# EAGLE design main (EAGLE 7.4.0)
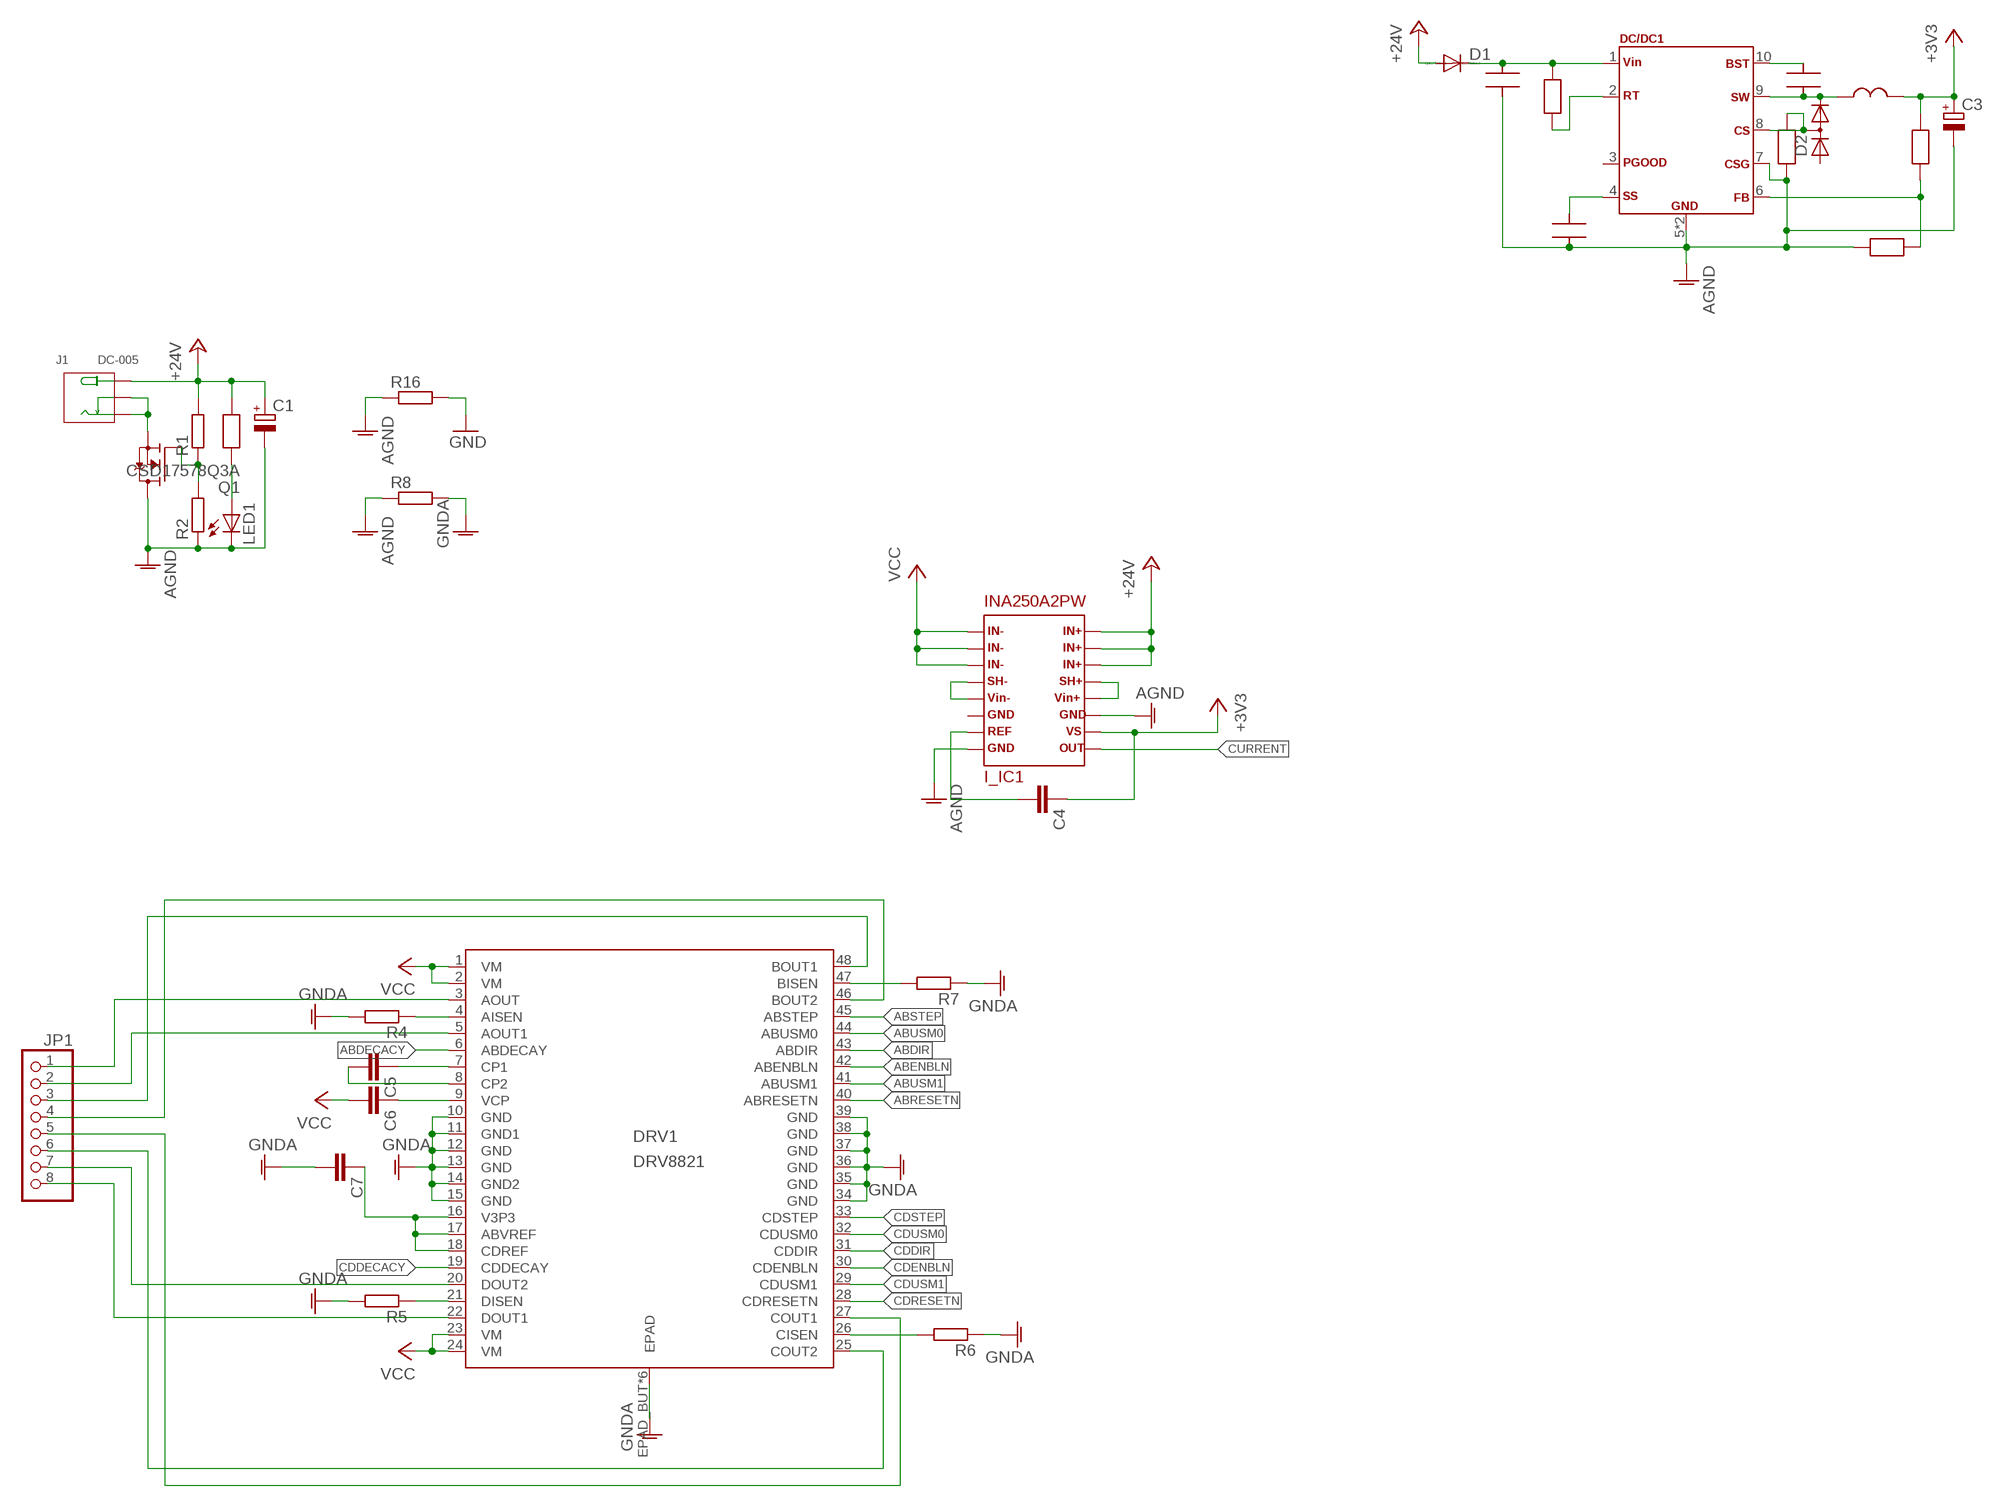
[diagram p0: schematic, sheet 1, part 1 of 2]
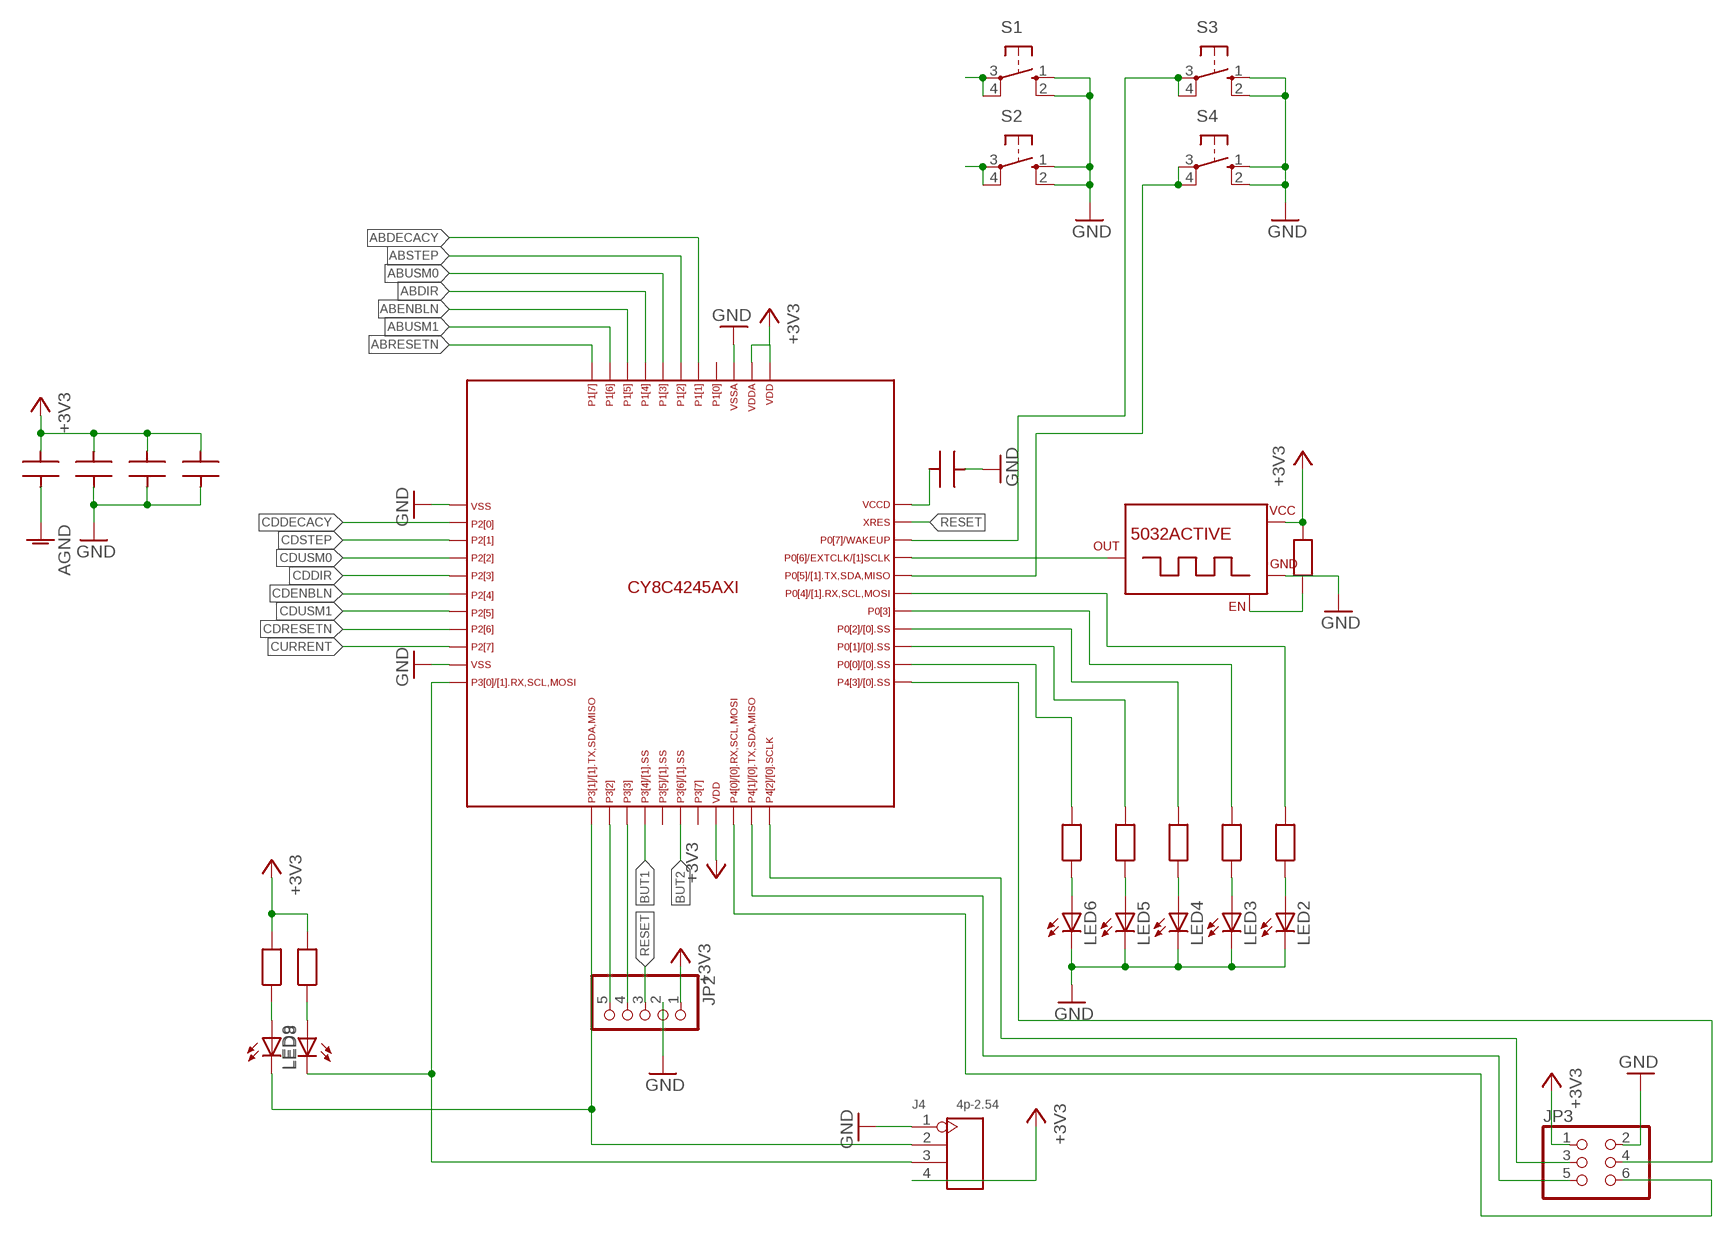
[diagram p1: schematic, sheet 1, part 2 of 2]

## Parts
C1  CPOL-EUSMCD  [SMC_D]
C2  CAP0603  [C0603]
C3  CPOL-EUSMCD  [SMC_D]
C4  C-EUC0805  [C0805]
C5  C-EUC0805  [C0805]
C6  C-EUC0805  [C0805]
C7  C-EUC0805  [C0805]
C8  CAP0603  [C0603]
C9  CAP0603  [C0603]
C10  CAP0603  [C0603]
C11  CAP0603  [C0603]
C12  CAP0603  [C0603]
C13  CAP0603  [C0603]
C14  CAP0603  [C0603]
D1  DIODE-DO-214AC  [DO-214AC]
D2  DIODE_2CACA-SOT23  [SOT23]
DC/DC1  LM25011  [HVSSOP-10]
DRV1  DRV8821  [HTSSOP_48]
I_IC1  INA250A2PW  [SSOP16]
J1  DC-005  CONN-POWER-JACK-2.1MM(DC-005)  [DCJ3P-14.2X11.0X9.0MM]
J4  4p-2.54  DIP-BLACK-FEMALE-HEADER-VERT(4P-2.54)  [H4-2.54]
JP1  PINHD-1X8  [1X08]
JP2  PINHD-1X5  [1X05]
JP3  PINHD-2X3  [2X03]
L1  L0603  [L0603]
LED1  LEDCHIP-LED0805  [CHIP-LED0805]
LED2  LEDCHIP-LED0603  [CHIP-LED0603]
LED3  LEDCHIP-LED0603  [CHIP-LED0603]
LED4  LEDCHIP-LED0603  [CHIP-LED0603]
LED5  LEDCHIP-LED0603  [CHIP-LED0603]
LED6  LEDCHIP-LED0603  [CHIP-LED0603]
LED8  LEDCHIP-LED0603  [CHIP-LED0603]
LED9  LEDCHIP-LED0603  [CHIP-LED0603]
Q1  CSD17578Q3A  [VSONP8]
R1  R-EU_M0805  [M0805]
R2  R-EU_M0805  [M0805]
R3  RES0603  [R0603]
R4  R-EU_M0805  [M0805]
R5  R-EU_M0805  [M0805]
R6  R-EU_M0805  [M0805]
R7  R-EU_M0805  [M0805]
R8  R-EU_M0805  [M0805]
R9  RES0603  [R0603]
R10  RES0603  [R0603]
R11  RES0603  [R0603]
R12  RES0603  [R0603]
R13  RES0603  [R0603]
R14  RES0603  [R0603]
R15  RES0603  [R0603]
R16  R-EU_M0805  [M0805]
R17  RES0603  [R0603]
R18  RES0603  [R0603]
R19  RES0603  [R0603]
R20  RES0603  [R0603]
R21  RES0603  [R0603]
S1  10-XX  [B3F-10XX]
S2  10-XX  [B3F-10XX]
S3  10-XX  [B3F-10XX]
S4  10-XX  [B3F-10XX]
U$1  CY8C4245  [TQFP44_CY_LOGO]
U$4  5032ACTIVE  [5030A]

## Nets
+3V3: C3.+ C4.1 C10.1 C12.1 C13.1 C14.1 I_IC1.P$10 J4.4 JP2.1 JP3.1 L1.2 R14.2 R15.2 R17.1 R21.1 U$1.19 U$1.34 U$1.35 U$4.4(+5V)
+24V: C1.+ D1.A I_IC1.P$14 I_IC1.P$15 I_IC1.P$16 J1.+ R1.2 R3.2
ABDECACY: DRV1.6(ABDECAY) U$1.38
ABDIR: DRV1.43(ABDIR) U$1.41
ABENBLN: DRV1.42(ABENBLN) U$1.42
ABRESETN: DRV1.40(ABRESETN) U$1.44
ABSTEP: DRV1.45(ABSTEP) U$1.39
ABUSM0: DRV1.44(ABUSM0) U$1.40
ABUSM1: DRV1.41(ABUSM1) U$1.43
AGND: C1.- C2.1 C3.- C8.1 C14.2 DC/DC1.5 DC/DC1.7 DC/DC1.EPAD I_IC1.P$8 I_IC1.P$11 LED1.C Q1.D1(D) Q1.D2(D) Q1.D3(D) Q1.D4(D) Q1.D5(D) R2.1 R8.1 R16.1 R19.1 R20.2
BUT1: S1.3(P) S1.4(P1) U$1.15
BUT2: S2.3(P) S2.4(P1) U$1.17
CDDECACY: DRV1.19(CDDECAY) U$1.2
CDDIR: DRV1.31(CDDIR) U$1.5
CDENBLN: DRV1.30(CDENBLN) U$1.6
CDRESETN: DRV1.28(CDRESETN) U$1.8
CDSTEP: DRV1.33(CDSTEP) U$1.3
CDUSM0: DRV1.32(CDUSM0) U$1.4
CDUSM1: DRV1.29(CDUSM1) U$1.7
CURRENT: I_IC1.P$9 U$1.9
GND: C10.2 C11.1 C12.2 C13.2 J4.1 JP2.2 JP3.2 LED2.C LED3.C LED4.C LED5.C LED6.C R16.2 S1.1(S) S1.2(S1) S2.1(S) S2.2(S1) S3.1(S) S3.2(S1) S4.1(S) S4.2(S1) U$1.1 U$1.10 U$1.36 U$4.2(GND)
GNDA: C7.2 DRV1.10(GND) DRV1.11(GND1) DRV1.12(GND) DRV1.13(GND) DRV1.14(GND2) DRV1.15(GND) DRV1.34(GND) DRV1.35(GND) DRV1.36(GND) DRV1.37(GND) DRV1.38(GND) DRV1.39(GND) DRV1.EPAD_BUT(EPAD) DRV1.EPAD_TOP(EPAD) DRV1.EPAD_VIA1(EPAD) DRV1.EPAD_VIA2(EPAD) DRV1.EPAD_VIA3(EPAD) DRV1.EPAD_VIA4(EPAD) R4.2 R5.2 R6.1 R7.1 R8.2
N$1: J1.-1(-) J1.-2(CDN) Q1.S1(S) Q1.S2(S) Q1.S3(S)
N$2: C2.2 D1.C DC/DC1.1 R18.2
N$3: Q1.G R1.1 R2.2
N$4: LED1.A R3.1
N$5: C8.2 DC/DC1.4
N$6: DRV1.3(AOUT) JP1.1
N$7: DRV1.5(AOUT1) JP1.2
N$8: DRV1.22(DOUT1) JP1.8
N$9: DRV1.20(DOUT2) JP1.7
N$10: DRV1.48(BOUT1) JP1.3
N$11: DRV1.46(BOUT2) JP1.4
N$12: DRV1.25(COUT2) JP1.6
N$13: DRV1.27(COUT1) JP1.5
N$14: I_IC1.P$4 I_IC1.P$5
N$15: I_IC1.P$12 I_IC1.P$13
N$16: C4.2 I_IC1.P$7
N$17: C5.1 DRV1.7(CP1)
N$18: C5.2 DRV1.8(CP2)
N$19: C6.1 DRV1.9(VCP)
N$20: JP3.4 U$1.23
N$21: DRV1.4(AISEN) R4.1
N$22: DRV1.21(DISEN) R5.1
N$23: DRV1.26(CISEN) R6.2
N$24: DRV1.47(BISEN) R7.2
N$25: JP3.3 U$1.22
N$26: DC/DC1.2 R18.1
N$27: C7.1 DRV1.16(V3P3) DRV1.17(ABVREF) DRV1.18(CDREF)
N$28: R13.2 U$1.28
N$29: R12.2 U$1.27
N$30: R11.2 U$1.26
N$31: R10.2 U$1.25
N$32: R9.2 U$1.24
N$33: JP3.5 U$1.21
N$36: S3.3(P) S3.4(P1) U$1.31
N$37: S4.3(P) S4.4(P1) U$1.29
N$38: JP3.6 U$1.20
N$39: LED6.A R9.1
N$40: LED5.A R10.1
N$41: LED4.A R11.1
N$42: LED3.A R12.1
N$43: LED2.A R13.1
N$44: J4.2 LED8.C U$1.12
N$45: J4.3 LED9.C U$1.11
N$48: R17.2 U$4.1(EN)
N$49: LED9.A R15.1
N$50: LED8.A R14.1
N$51: C9.2 DC/DC1.10
N$52: C9.1 D2.2(C) DC/DC1.9 L1.1
N$53: JP2.5 U$1.13
N$54: JP2.4 U$1.14
N$56: U$1.30 U$4.3(OUT)
N$57: D2.3(AC) DC/DC1.8 R19.2
N$58: C11.2 U$1.33
N$60: DC/DC1.6 R20.1 R21.2
RESET: JP2.3 U$1.32
VCC: C6.2 DRV1.1(VM) DRV1.2(VM) DRV1.23(VM) DRV1.24(VM) I_IC1.P$1 I_IC1.P$2 I_IC1.P$3
Unconnected: D2.1(A) DC/DC1.3 I_IC1.P$6 U$1.16 U$1.18 U$1.37

## Library data of the parts
C1 C3 = rcl:CPOL-EU: POLARIZED CAPACITOR, European symbol
C2 C8-C14 = My_RLC:CAP0603: Ceramic Capasitor SMD 0603
C4-C7 = rcl:C-EU: CAPACITOR, European symbol
D1 = diode:DIODE-: DIODE
D2 = diode:DIODE_2CACA-: 2 Diodes - Cathode-Anode|Cathode-Anode
DC/DC1 = My_TI:LM25011: LM25011 Constant On-Time Switching Regulator With Adjustable Current Limit. Input Operating Voltage Range: 6 V to 42 V. Integrated 2-A N-Channel Buck Switch. Adjustable Current Limit Allows for Smaller inductor. Adjustable Output Voltage from 2.51 V. Datasheet <http://www.ti.com/lit/ds/symlink/lm25011.pdf>
DRV1 = My_TI:DRV8821: DRV8821 DUAL STEPPER MOTOR CONTROLLER/DRIVER 8-V to 32-V Operating Supply Voltage Range Up to 1.5-A Current Per Winding Up to 1.5-A Current Per Winding Datasheet <http://www.ti.com/lit/ds/symlink/drv8821.pdf>
I_IC1 = My_TI:INA250A2PW: 36-V, Low- or High-Side, Bidirectional, Zero-Drift Current-Shunt Monitor with Precision Integrated Shunt Resistor
J1 = Seeed-OPL-Connector:CONN-POWER-JACK-2.1MM(DC-005): 320120003; MPN: DC-005
J4 = Seeed-OPL-Connector:DIP-BLACK-FEMALE-HEADER-VERT(4P-2.54): 320030017; MPN: F185-1104A1BSYA1
JP1 = pinhead:PINHD-1X8: PIN HEADER
JP2 = pinhead:PINHD-1X5: PIN HEADER
JP3 = pinhead:PINHD-2X3: PIN HEADER
L1 = My_RLC:L0603: Inductor SMD 0603
LED1-LED6 LED8 LED9 = led:LED: LED OSRAM: - CHIPLED LG R971, LG N971, LY N971, LG Q971, LY Q971, LO R971, LY R971 LH N974, LH R974 LS Q976, LO Q976, LY Q976 LO Q996 - Hyper CHIPLED LW Q18S LB Q993, LB Q99A, LB R99A - SideLED LS A670, LO A670, LY A670, LG A670, LP A670 LB A673, LV A673, LT A673, LW A673 LH A674 LY A675 LS A676, LA A676, LO A676, LY A676, LW A676 LS A679, LY A679, LG A679 - Hyper Micro SIDELED® LS Y876, LA Y876, LO Y876, LY Y876 LT Y87S - SmartLED LW L88C, LW L88S LB L89C, LB L89S, LG L890 LS L89K, LO L89K, LY L89K LS L896, LA L896, LO L896, LY L896 - TOPLED LS T670, LO T670, LY T670, LG T670, LP T670 LSG T670, LSP T670, LSY T670, LOP T670, LYG T670 LG T671, LOG T671, LSG T671 LB T673, LV T673, LT T673, LW T673 LH T674 LS T676, LA T676, LO T676, LY T676, LB T676, LH T676, LSB T676, LW T676 LB T67C, LV T67C, LT T67C, LS T67K, LO T67K, LY T67K, LW E67C LS E67B, LA E67B, LO E67B, LY E67B, LB E67C, LV E67C, LT E67C LW T67C LS T679, LY T679, LG T679 LS T770, LO T770, LY T770, LG T770, LP T770 LB T773, LV T773, LT T773, LW T773 LH T774 LS E675, LA E675, LY E675, LS T675 LS T776, LA T776, LO T776, LY T776, LB T776 LHGB T686 LT T68C, LB T68C - Hyper Mini TOPLED® LB M676 - Mini TOPLED Santana® LG M470 LS M47K, LO M47K, LY M47K Source: http://www.osram.convergy.de LUXEON: - LUMILED® LXK2-PW12-R00, LXK2-PW12-S00, LXK2-PW14-U00, LXK2-PW14-V00 LXK2-PM12-R00, LXK2-PM12-S00, LXK2-PM14-U00 LXK2-PE12-Q00, LXK2-PE12-R00, LXK2-PE12-S00, LXK2-PE14-T00, LXK2-PE14-U00 LXK2-PB12-K00, LXK2-PB12-L00, LXK2-PB12-M00, LXK2-PB14-N00, LXK2-PB14-P00, LXK2-PB14-Q00 LXK2-PR12-L00, LXK2-PR12-M00, LXK2-PR14-Q00, LXK2-PR14-R00 LXK2-PD12-Q00, LXK2-PD12-R00, LXK2-PD12-S00 LXK2-PH12-R00, LXK2-PH12-S00 LXK2-PL12-P00, LXK2-PL12-Q00, LXK2-PL12-R00 Source: www.luxeon.com KINGBRIGHT: KA-3528ASYC Source: www.kingbright.com
Q1 = Mosfet_Logic:CSD17578Q3A: 30 V N-Channel NexFET™ Power MOSFETs. 14/142A
R1 R2 R4-R8 R16 = rcl:R-EU_: RESISTOR, European symbol
R3 R9-R15 R17-R21 = My_RLC:RES0603: Resistor SMD 0603
S1-S4 = switch-omron:10-XX: OMRON SWITCH; MPN: B3F-1000; OC_FARNELL: 176432; OC_NEWARK: 36M3542
U$1 = PsoC:CY8C4245
U$4 = Oscillatrs:5032ACTIVE

## Board
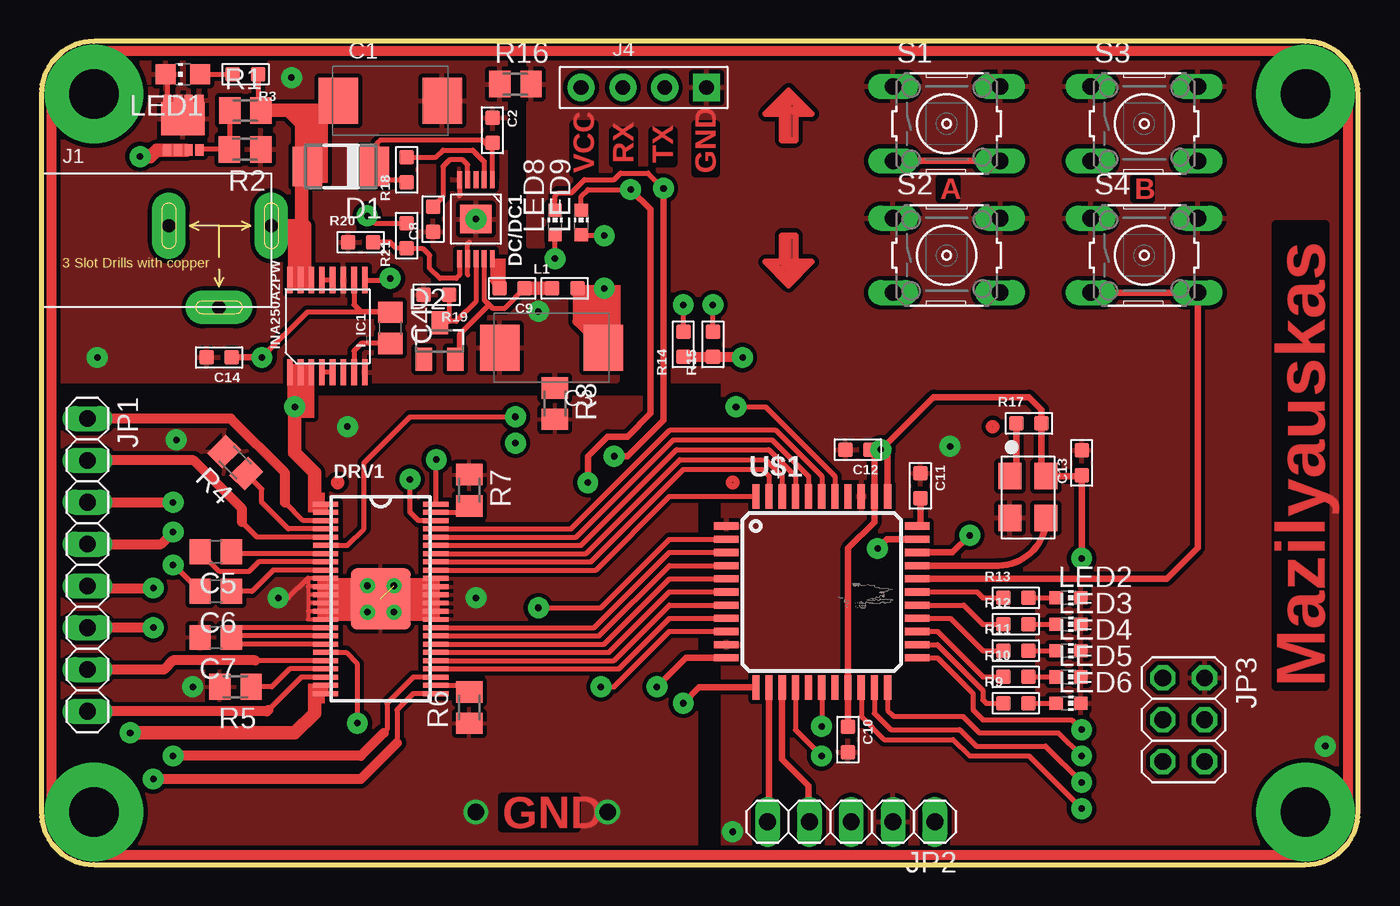
[diagram p2: board, top side]
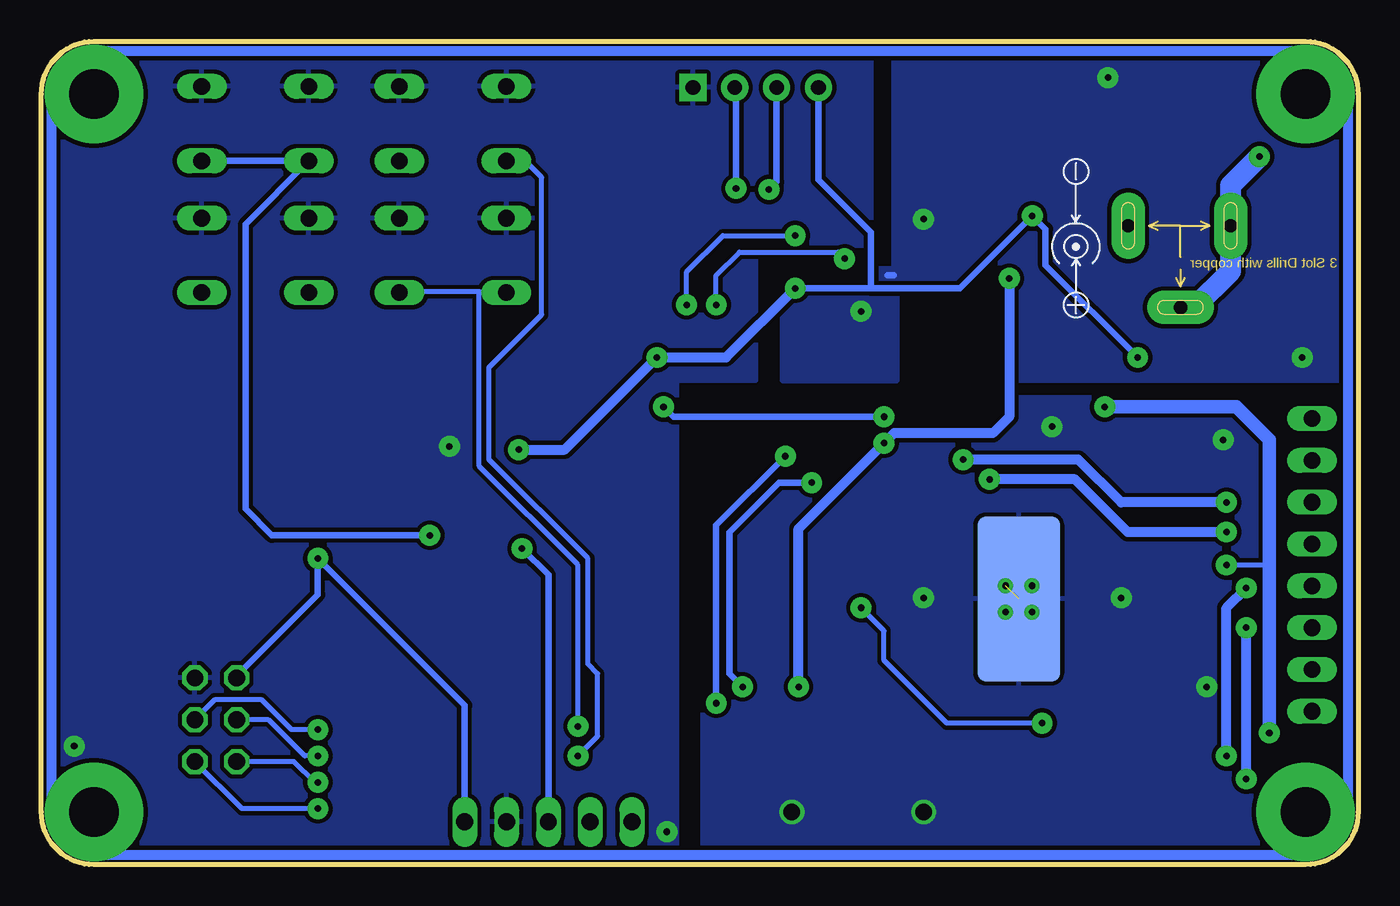
[diagram p3: board, bottom side, seen from below]

Size 80 x 50 mm. Coordinates in mm from the lower left corner, seen from the top.
Outline: 3.2,0 76.8,0 arc90 80,3.2 80,46.8 arc90 76.8,50 3.2,50 arc90 0,46.8 0,3.2 arc90 3.2,0
Copper layers (1*16): Top 0.035mm / dielectric 1.5mm / Bottom 0.035mm
Design rules "default": minimum track width 10mil, minimum drill 24mil, track to track 8mil, track to pad 8mil, pad to pad 8mil, via to via 8mil, smd to smd 8mil, copper to edge 40mil, drill to drill 8mil, minimum pad ring 10mil, minimum via ring 8mil, stop-mask expansion 4mil, vias tented up to drill 0mil, thermal gap 10mil

### Footprints (pad centres in the part's own frame; a part is rotated, then mirrored left to right if it is on the bottom)
SMC_D = smd 2.4 x 2.8: + -3.15,0; - 3.15,0
C0603 = smd 0.889 x 0.889: 1 0,0.762; 2 0,-0.762
C0805 = smd 1.3 x 1.5: 1 -0.95,0; 2 0.95,0
DO-214AC = smd 1.8 x 2.4: A 2.025,0; C -2.025,0
SOT23 = smd 1 x 1.4: 1 -0.95,-1.1; 2 0.95,-1.1; 3 0,1.1
HVSSOP-10 = smd 0.3 x 1.02: 1 -1,-2.4; 2 -0.5,-2.4; 3 0,-2.4; 4 0.5,-2.4; 5 1,-2.4; 6 1,2.4; 7 0.5,2.4; 8 0,2.4; 9 -0.5,2.4; 10 -1,2.4 | smd 1.9 x 1.73: EPAD 0,0
HTSSOP_48 = smd 1.6 x 0.3: 1 -3.35,5.75; 2 -3.35,5.25; 3 -3.35,4.75; 4 -3.35,4.25; 5 -3.35,3.75; 6 -3.35,3.25; 7 -3.35,2.75; 8 -3.35,2.25; 9 -3.35,1.75; 10 -3.35,1.25; 11 -3.35,0.75; 12 -3.35,0.25; 13 -3.35,-0.25; 14 -3.35,-0.75; 15 -3.35,-1.25; 16 -3.35,-1.75; 17 -3.35,-2.25; 18 -3.35,-2.75; 19 -3.35,-3.25; 20 -3.35,-3.75; 21 -3.35,-4.25; 22 -3.35,-4.75; 23 -3.35,-5.25; 24 -3.35,-5.75; 25 3.35,-5.75; 26 3.35,-5.25; 27 3.35,-4.75; 28 3.35,-4.25; 29 3.35,-3.75; 30 3.35,-3.25; 31 3.35,-2.75; 32 3.35,-2.25; 33 3.35,-1.75; 34 3.35,-1.25; 35 3.35,-0.75; 36 3.35,-0.25; 37 3.35,0.25; 38 3.35,0.75; 39 3.35,1.25; 40 3.35,1.75; 41 3.35,2.25; 42 3.35,2.75; 43 3.35,3.25; 44 3.35,3.75; 45 3.35,4.25; 46 3.35,4.75; 47 3.35,5.25; 48 3.35,5.75 | smd 5 x 10 bottom: EPAD_BUT 0,0 | smd 3.65 x 3.7: EPAD_TOP 0,0 | drill 0.4: EPAD_VIA1 -0.8,0.8; EPAD_VIA2 0.8,0.8; EPAD_VIA3 0.8,-0.8; EPAD_VIA4 -0.8,-0.8
SSOP16 = smd 0.35 x 1.6: P$1 -2.3,-2.9; P$2 -1.65,-2.9; P$3 -1,-2.9; P$4 -0.35,-2.9; P$5 0.3,-2.9; P$6 0.95,-2.9; P$7 1.6,-2.9; P$8 2.25,-2.9; P$9 2.25,2.7; P$10 1.6,2.7; P$11 0.95,2.7; P$12 0.3,2.7; P$13 -0.35,2.7; P$14 -1,2.7; P$15 -1.65,2.7; P$16 -2.3,2.7
DCJ3P-14.2X11.0X9.0MM = drill 0.813 pad 2.032 long: + 3.175,0; -1 -3.048,0; -2 0,-4.953
H4-2.54 = drill 0.889 pad 1.651 square: 1 0,3.81 | drill 0.889 pad 1.651: 2 0,1.27; 3 0,-1.27; 4 0,-3.81
1X08 = drill 1.016 long: 1 -8.89,0; 2 -6.35,0; 3 -3.81,0; 4 -1.27,0; 5 1.27,0; 6 3.81,0; 7 6.35,0; 8 8.89,0
1X05 = drill 1.016 long: 1 -5.08,0; 2 -2.54,0; 3 0,0; 4 2.54,0; 5 5.08,0
2X03 = drill 1.016 octagon: 1 -2.54,-1.27; 2 -2.54,1.27; 3 0,-1.27; 4 0,1.27; 5 2.54,-1.27; 6 2.54,1.27
L0603 = smd 0.889 x 0.889: 1 -0.762,0; 2 0.762,0
CHIP-LED0805 = smd 1.2 x 1.2: A 0,-1.05; C 0,1.05
CHIP-LED0603 = smd 0.8 x 0.8: A 0,-0.75; C 0,0.75
VSONP8 = smd 2.65 x 2.01: D1 -1,1.9 | smd 0.5 x 0.68: D2 0,3.03; D3 -0.65,3.03; D4 -1.3,3.03; D5 -1.95,3.03; G 0,0; S1 -1.95,0; S2 -1.3,0; S3 -0.65,0
M0805 = smd 1.3 x 1.6: 1 -0.95,0; 2 0.95,0
R0603 = smd 0.889 x 0.889: 1 0,0.762; 2 0,-0.762
B3F-10XX = drill 1.016 long: 1 -3.251,2.261; 2 3.251,2.261; 3 -3.251,-2.261; 4 3.251,-2.261
TQFP44_CY_LOGO = smd 1.5 x 0.44: 1 -5.8,4; 2 -5.8,3.2; 3 -5.8,2.4; 4 -5.8,1.6; 5 -5.8,0.8; 6 -5.8,0; 7 -5.8,-0.8; 8 -5.8,-1.6; 9 -5.8,-2.4; 10 -5.8,-3.2; 11 -5.8,-4; 23 5.8,-4; 24 5.8,-3.2; 25 5.8,-2.4; 26 5.8,-1.6; 27 5.8,-0.8; 28 5.8,0; 29 5.8,0.8; 30 5.8,1.6; 31 5.8,2.4; 32 5.8,3.2; 33 5.8,4 | smd 0.44 x 1.5: 12 -4,-5.8; 13 -3.2,-5.8; 14 -2.4,-5.8; 15 -1.6,-5.8; 16 -0.8,-5.8; 17 0,-5.8; 18 0.8,-5.8; 19 1.6,-5.8; 20 2.4,-5.8; 21 3.2,-5.8; 22 4,-5.8; 34 4,5.8; 35 3.2,5.8; 36 2.4,5.8; 37 1.6,5.8; 38 0.8,5.8; 39 0,5.8; 40 -0.8,5.8; 41 -1.6,5.8; 42 -2.4,5.8; 43 -3.2,5.8; 44 -4,5.8
5030A = smd 1.6 x 1.4: 1 0,-2.2; 2 2.54,-2.2; 3 2.54,0; 4 0,0

### Placement (x,y rotation side)
C1  21.2,46.4 0 top
C2  27.4,44.6 0 top
C3  31,31.4 180 top
C4  21.2,32.6 270 top
C5  10.6,19 180 top
C6  10.6,16.6 180 top
C7  10.6,13.8 180 top
C8  23.8,39.2 180 top
C9  28.6,35 270 top
C10  49,7.6 0 top
C11  53.4,23 0 top
C12  49.6,25.2 270 top
C13  63.2,24.4 180 top
C14  10.8,30.8 270 top
D1  18.2,42.4 180 top
D2  24.2,31.8 0 top
DC/DC1  26.4,39.2 180 top
DRV1  20.62,16.14 0 top
I_IC1  17.4,32.8 0 top
J1  10.8,38.8 0 top
J4  36.6,47.2 270 top
JP1  2.8,18.2 270 top
JP2  49.2,2.6 180 top
JP3  69.4,8.8 270 top
L1  31.8,35 0 top
LED1  8.6,48 90 top
LED2  62.4,16.2 270 top
LED3  62.4,14.6 270 top
LED4  62.4,13 270 top
LED5  62.4,11.4 270 top
LED6  62.4,9.8 270 top
LED8  31.2,39 0 top
LED9  32.8,39 0 top
Q1  9.6,43.4 0 top
R1  12.4,45.8 0 top
R2  12.38,43.44 180 top
R3  12.4,48 90 top
R4  11.78,24.42 135 top
R5  11.8,10.8 180 top
R6  26,9.54 90 top
R7  26,22.74 270 top
R8  31.2,28 270 top
R9  59.2,9.8 270 top
R10  59.2,11.4 270 top
R11  59.2,13 270 top
R12  59.2,14.6 270 top
R13  59.2,16.2 270 top
R14  39,31.6 0 top
R15  40.8,31.6 0 top
R16  28.8,47.4 0 top
R17  60,26.8 270 top
R18  22.2,42.2 0 top
R19  24,34.6 90 top
R20  19.4,37.8 270 top
R21  22.2,38.2 0 top
S1  55,45 0 top
S2  55,37 0 top
S3  67,45 0 top
S4  67,37 0 top
U$1  47.41,16.56 0 top
U$4  61.04,23.6 270 top

### Tracks (layer width: path | path; a pad name or v marks a point on that pad's centre or on a via)
+3V3  (via drill 0.4 pad 1.27)
  Top 0.305: L1.2 v34.2,35 | v19.8,39.4 20.24,38.96 R21.1 | I_IC1.P$10 19,34 19.4,33.6 21.15,33.6 C4.1 16.15,33.55 v13.4,30.8
  Top 0.406: U$1.34 51.41,24.79 v51,25.2 | v51,25.2 50.61,24.81 U$1.35 50.6,20.8 49.01,19.21 U$1.19 49.01,8.39 arc90 49,8.38 C10.1 | v51,25.2 54.2,28.4 60,28.4 60.76,27.64 R17.1 60.76,23.88 U$4.4 63.16,23.6 arc90 C13.1 v63.2,18.6 | C12.1 v51,25.2 | v13.4,30.8 C14.1
  Top 0.61: L1.2 32.56,32.99 C3.+ | R14.2 R15.2 40.84,30.8 v42.6,30.8
  Bottom 0.406: 29.6,35 29.6,38.4 32.79,41.59 J4.4 | 29.6,35 v34.2,35 | 29.6,35 24.2,35 v19.8,39.4 19,38.6 19,36.4 v13.4,30.8 | JP2.1 54.28,9.68 v63.2,18.6 63.2,16.4 68.13,11.47 JP3.1
  Bottom 0.61: v34.2,35 38.4,30.8 v42.6,30.8 48.2,25.2 v51,25.2
+24V
  Top 0.305: R3.2 13.16,45.99 R1.2 | I_IC1.P$15 15.75,38.65 15.6,38.8 | I_IC1.P$16 I_IC1.P$15 | I_IC1.P$15 I_IC1.P$14
  Top 0.813: J1.+ 15.6,38.8 16,38.8 15.8,39 15.8,42.4 | R1.2 15,45.8 15.8,45 | 15.8,45 15.8,42.4 | 15.8,45 16.65,45 C1.+ | D1.A 15.8,42.4
  Bottom 0.813: 14,38.77 J1.+
ABDECACY  (via drill 0.4 pad 1.27)
  Top 0.305: DRV1.6 18.59,19.39 19.6,20.4 19.6,24.4 22.4,27.2 v28.8,27.2 | v42.2,27.8 44,27.8 48.21,23.59 U$1.38
  Bottom 0.406: v28.8,27.2 41.6,27.2 v42.2,27.8
ABDIR
  Top 0.305: DRV1.43 32.79,19.39 38.6,25.2 44.2,25.2 45.81,23.59 U$1.41
ABENBLN
  Top 0.305: DRV1.42 33.09,18.89 38.8,24.6 44,24.6 45.01,23.59 U$1.42
ABRESETN
  Top 0.305: DRV1.40 33.69,17.89 38.16,22.36 U$1.44
ABSTEP
  Top 0.305: DRV1.45 32.19,20.39 38.2,26.4 44.6,26.4 47.41,23.59 U$1.39
ABUSM0
  Top 0.305: DRV1.44 32.49,19.89 38.4,25.8 44.4,25.8 46.61,23.59 U$1.40
ABUSM1
  Top 0.305: DRV1.41 33.39,18.39 39,24 43.8,24 44.21,23.59 U$1.43
AGND  (via drill 0.4 pad 1.27)
  Top 0.305: Q1.D1 8.3,45.6 Q1.D4 Q1.D5 7.65,47.9 LED1.C | Q1.D3 Q1.D2 | DC/DC1.5 25.4,40.6 | 26,37.8 25.9,37.7 DC/DC1.7 25.9,35.8
  Bottom 0.406: 28.2,35.8 28.6,35.8
  other vias: 15.2,47.8 3.4,30.8 26.4,39.2 30.2,33.6
  pour Top (isolate 0.254): 0,29.4 28.2,29.4 28.2,50 3.2,50 arc90 0,46.8
  pour Bottom (isolate 0.254): 0,29.4 28.2,29.4 28.2,50 3.2,50 arc90 0,46.8
  pour Top (isolate 0.254): 28,29.4 35,29.4 35,36.2 28,36.2
  pour Bottom (isolate 0.254): 35,36.2 35,29.4 28,29.4 28,36.2
BUT1  (via drill 0.4 pad 1.27)
  Top 0.305: U$1.15 45.81,8.19 v47.4,6.6
  Top 0.406: S1.3 S1.4
  Bottom 0.305: v47.4,6.6 46.2,7.8 46.2,11.6 46.8,12.2 46.8,18.6 52.8,24.6 52.8,30.2 49.6,33.4 49.6,41.74 50.6,42.74 S1.3
BUT2  (via drill 0.4 pad 1.27)
  Top 0.305: U$1.17 v47.41,8.41 v47.4,8.4
  Bottom 0.305: v47.4,8.4 47.4,18.2 53.4,24.2 53.4,34.8 | 53.4,34.8 51.81,34.8 S2.3 | 53.4,34.8 58.19,34.8 S2.4
CDDECACY  (via drill 0.4 pad 1.27)
  Top 0.305: DRV1.19 18.51,12.89 19.2,12.2 v19.2,8.6 | v30.2,15.6 34,15.6 38.16,19.76 U$1.2
  Bottom 0.305: v19.2,8.6 25,8.6 28.8,12.4 28.8,14.2 v30.2,15.6
CDDIR
  Top 0.305: DRV1.31 34.19,13.39 38.16,17.36 U$1.5
CDENBLN
  Top 0.305: DRV1.30 34.49,12.89 38.16,16.56 U$1.6
CDRESETN
  Top 0.305: DRV1.28 35.09,11.89 38.16,14.96 U$1.8
CDSTEP
  Top 0.305: DRV1.33 33.59,14.39 38.16,18.96 U$1.3
CDUSM0
  Top 0.305: DRV1.32 33.89,13.89 38.16,18.16 U$1.4
CDUSM1
  Top 0.305: DRV1.29 34.79,12.39 38.16,15.76 U$1.7
CURRENT  (via drill 0.4 pad 1.27)
  Top 0.305: 29.15,25.95 v28.8,25.6 | v34,10.8 34.8,10.8 38.16,14.16 U$1.9 | I_IC1.P$9 21.1,35.5 v21.2,35.6
  Bottom 0.61: v34,10.8 34,20.4 v28.8,25.6 28.2,26.2 22.2,26.2 21.2,27.2 v21.2,35.6
GND  (via drill 0.4 pad 1.27)
  other vias: 78,7.2 42,2 55.2,25.4
  pour Bottom (isolate 0.254): 41.4,0 80,0 80,50 29.6,50 29.6,37.6 36.6,37.6 36.6,29.4 41.4,29.4
  pour Top (isolate 0.254): 41.4,0 80,0 80,50 29.6,50 29.6,37.6 36.6,37.6 36.6,29.4 41.4,29.4
GNDA  (via drill 0.4 pad 1.27, 1)  (2 unrouted)
  Top 0.254: 16.6,17.4 16.2,17.4 16.2,16.92 | 16.2,16.92 16.2,15.4 | 16.2,15.4 16.2,14.9 16.66,14.9 16.67,14.89 DRV1.15 | 16.2,15.4 DRV1.14 | 16.28,15.9 DRV1.13 | DRV1.12 16.24,16.4 | DRV1.11 16.18,16.9 16.2,16.92 | DRV1.39 | DRV1.37 23.41,16.39 23.4,16.4 23.4,15.4 DRV1.35
  Top 0.305: DRV1.14 19.77,15.39 DRV1.EPAD_VIA4 | DRV1.38 21.47,16.89 DRV1.EPAD_VIA2 | DRV1.10 DRV1.11 DRV1.12 | DRV1.12 | DRV1.12 DRV1.13 | DRV1.39 DRV1.38 | DRV1.38 DRV1.37 DRV1.36 | DRV1.35 DRV1.34 | 16.2,17.4 15,16.2 v14.4,16.2
  Bottom 0.305: DRV1.EPAD_VIA1 DRV1.EPAD_TOP DRV1.EPAD_VIA3
  other vias: 8.2,25.8 9.2,10.8 34.4,3.2 26.4,16.2 26.4,3.2 18.6,26.6
  pour Top (isolate 0.254): 0,28.4 39.8,28.4 39.8,0 0,0
  pour Bottom (isolate 0.254): 39.8,28.4 0,28.4 0,0 39.8,0
N$1  (via drill 0.4 pad 1.27)
  Top 0.406: 7,43.4 Q1.S1 Q1.S2 8.8,43.4 Q1.S3
  Top 0.813: 8.8,43.4 7,43.4 6.6,43 v6,43
  Bottom 1.27: J1.-2 9.95,33.85 7.75,36.05 J1.-1 7.75,41.25 v6,43
N$2
  Top 0.305: R18.2 22.04,41.6 20.4,41.6 20.23,41.77 D1.C 20.4,42.58 20.4,43.8 20.6,44 26.8,44 27.4,43.4 | DC/DC1.1 27.4,43.4 | 27.4,43.4 C2.2
N$3
  Top 0.305: R1.1 11.45,43.46 R2.2 9.64,43.44 Q1.G
N$4
  Top 0.305: LED1.A R3.1
N$5
  Top 0.305: DC/DC1.4 25.9,42.5 25.6,42.8 24.8,42.8 24.4,42.4 24.4,40.56 C8.2
N$6
  Top 0.305: DRV1.3 15.91,20.89 14.8,22
  Top 0.61: 14.8,22 14.8,23.8 11.51,27.09 JP1.1
N$7
  Top 0.305: DRV1.5 13.11,19.89 12.2,20.8
  Top 0.61: 12.2,20.8 12.2,21.6 9.25,24.55 JP1.2
N$8
  Top 0.305: DRV1.22 15.79,11.39 13.8,9.4
  Top 0.61: 13.8,9.4 13.71,9.31 JP1.8
N$9
  Top 0.305: DRV1.20 13.01,12.39 13,12.4
  Top 0.61: 13,12.4 8,12.4 7.45,11.85 JP1.7
N$10  (via drill 0.4 pad 1.27)
  Top 0.305: DRV1.48 23.97,24.57 v24,24.6
  Top 0.61: JP1.3 v7.99,22.01 v8,22
  Bottom 0.61: v8,22 14.4,22 17,24.6 v24,24.6
N$11  (via drill 0.4 pad 1.27)
  Top 0.305: DRV1.46 22.91,20.89 22.4,21.4 v22.4,23.4
  Top 0.61: JP1.4 7.27,19.47 v8,20.2
  Bottom 0.61: v8,20.2 14,20.2 17.2,23.4 v22.4,23.4
N$12  (via drill 0.4 pad 1.27)
  Top 0.305: DRV1.25 22.59,10.39 21.6,9.4 21.6,7.4
  Top 0.61: v6.8,14.4 v6.79,14.39 JP1.6 | 21.6,7.4 19.4,5.2 v6.8,5.2
  Bottom 0.61: v6.8,5.2 v6.8,14.4
N$13  (via drill 0.4 pad 1.27)
  Top 0.305: DRV1.27 22.59,11.39 21,9.8 21,8.2 20.8,8
  Top 0.61: JP1.5 2.93,16.8 v6.8,16.8 | 20.8,8 19.4,6.6 v8,6.6
  Bottom 0.61: v6.8,16.8 8,15.6 v8,6.6
N$14
  Top 0.305: I_IC1.P$5 I_IC1.P$4
N$15
  Top 0.305: I_IC1.P$12 I_IC1.P$13
N$16
  Top 0.305: C4.2 19.45,31.65 19,31.2 I_IC1.P$7
N$17
  Top 0.305: DRV1.7 11.66,18.89 C5.1
N$18
  Top 0.305: DRV1.8 13.19,18.39 12.6,17.8 10.85,17.8 C5.2
N$19
  Top 0.305: DRV1.9 14.09,17.89 12.8,16.6 C6.1
N$20  (via drill 0.4 pad 1.27)
  Top 0.305: U$1.23 54.44,12.56 56.6,10.4 56.6,9.4 57.2,8.8 62.6,8.8 v63.2,8.2
  Bottom 0.305: v63.2,8.2 64.8,8.2 66.6,10 69.47,10 JP3.4
N$21
  Top 0.305: DRV1.4 15.01,20.39 13.4,22 13.4,22.8 R4.1
N$22
  Top 0.305: DRV1.21 15.09,11.89 14,10.8 R5.1
N$23
  Top 0.305: DRV1.26 25.6,10.89 R6.2
N$24
  Top 0.305: DRV1.47 25.6,21.39 R7.2
N$25  (via drill 0.4 pad 1.27)
  Top 0.305: U$1.22 51.41,9.39 51.8,9 56,9 57,8 61.8,8 v63.2,6.6
  Bottom 0.305: v63.2,6.6 64,6.6 66.2,8.8 JP3.3
N$26
  Top 0.305: R18.1 23.96,42.96 24.4,43.4 26.2,43.4 26.9,42.7 DC/DC1.2
N$27
  Top 0.305: DRV1.17 11.55,13.89 C7.1 | DRV1.16 11.55,14.39 C7.1 | DRV1.18 11.55,13.39 C7.1
N$28
  Top 0.305: U$1.28 56.84,16.56 57.2,16.2 R13.2
N$29
  Top 0.305: U$1.27 56.04,15.76 57.2,14.6 R12.2
N$30
  Top 0.305: U$1.26 55.24,14.96 57.2,13 R11.2
N$31
  Top 0.305: U$1.25 54.44,14.16 57.2,11.4 R10.2
N$32
  Top 0.305: U$1.24 54.44,13.36 57.2,10.6 57.2,10 57.4,9.8 R9.2
N$33  (via drill 0.4 pad 1.27)
  Top 0.305: U$1.21 50.61,9.19 51.6,8.2 55.8,8.2 56.8,7.2 61,7.2 v63.2,5
  Bottom 0.305: v63.2,5 63.4,5 64.66,6.26 JP3.5
N$36  (via drill 0.4 pad 1.27)
  Top 0.406: U$1.31 55.36,18.96 v56.4,20
  Bottom 0.406: v56.4,20 66,20 67.6,21.6 67.6,38.89 S3.3 S3.4
N$37
  Top 0.406: U$1.29 68.36,17.36 70.25,19.25 S4.4 S4.3
N$38  (via drill 0.4 pad 1.27)
  Top 0.305: U$1.20 49.81,8.99 51.2,7.6 55.4,7.6 56.4,6.6 60,6.6 v63.2,3.4
  Bottom 0.305: v63.2,3.4 67.81,3.4 JP3.6
N$39
  Top 0.305: R9.1 LED6.A
N$40
  Top 0.305: R10.1 LED5.A
N$41
  Top 0.305: R11.1 LED4.A
N$42
  Top 0.305: R12.1 LED3.A
N$43
  Top 0.305: R13.1 LED2.A
N$44  (via drill 0.4 pad 1.27)
  Top 0.305: LED8.C 31.2,40.6 31.4,40.8 32.2,40.8 33,41.6 34.8,41.6 35.2,42 36.87,42 v37.8,41.07
  Top 0.406: U$1.12 39.96,10.76 v39,9.8 | v34.8,24.8 35.6,24.8 37.8,27 v37.8,41.07
  Bottom 0.406: v39,9.8 39,20.6 v34.8,24.8 | J4.2 37.8,47.13 v37.8,41.07
N$45  (via drill 0.4 pad 1.27)
  Top 0.305: LED9.C 32.8,40.6 33.2,41 v35.8,41
  Top 0.406: U$1.11 39.16,12.56 v37.4,10.8 | v33.2,23.2 33.2,24.8 34.4,26 35.6,26 37,27.4 37,39.8 v35.8,41
  Bottom 0.406: v33.2,23.2 35.2,23.2 38.2,20.2 38.2,11.6 v37.4,10.8 | v35.8,41 35.33,41.47 J4.3
N$46
  Top 0.406: 45.4,47 44,45.6 45,45.6 45,44 45.8,44 45.8,45.6 46.8,45.6 45.4,47 | 45.4,47 45.4,45.6 | 45.4,44.2 45.4,45.6 | 45.4,45.6 45.8,46 46,46 | 46,46 46.2,45.8 | 46,46 45.6,46.4 45.4,46.4 44.8,45.8 45,45.8 45.2,45.6 45.2,46.4 44.6,45.8
N$47
  Top 0.406: 45.4,35.2 46.8,36.6 45.8,36.6 45.8,38.2 45,38.2 45,36.6 44,36.6 45.4,35.2 | 45.4,35.2 45.4,36.6 | 45.4,38 45.4,36.6 | 45.4,36.6 45,36.2 44.8,36.2 | 44.8,36.2 44.6,36.4 | 44.8,36.2 45.2,35.8 45.4,35.8 46,36.4 45.8,36.4 45.6,36.6 45.6,35.8 46.2,36.4
N$48
  Top 0.406: U$4.1 59.24,24 R17.2
N$49  (via drill 0.4 pad 1.27)
  Top 0.305: R15.1 v40.8,34 | v34.2,38.2 32.85,38.2 LED9.A
  Bottom 0.305: v40.8,34 40.8,36 38.6,38.2 v34.2,38.2
N$50  (via drill 0.4 pad 1.27)
  Top 0.305: R14.1 v39,34 | v31.2,36.8 LED8.A
  Bottom 0.305: v39,34 39,35.8 37.6,37.2 31.6,37.2 v31.2,36.8
N$51
  Top 0.305: DC/DC1.10 27.4,35.44 C9.2
N$52
  Top 0.305: L1.1 C9.1 28.16,33.8 27.4,33.8 27.2,34 | DC/DC1.9 26.9,34.3 27.2,34 | D2.2 25.15,30.95 25.4,31.2 25.4,32.2 27.2,34
N$53
  Top 0.406: U$1.13 44.21,2.69 JP2.5
N$54
  Top 0.406: U$1.14 45.01,6.39 46.6,4.8 46.6,2.66 JP2.4
N$56
  Top 0.406: U$1.30 58.14,18.16 arc90 U$4.3
N$57
  Top 0.305: DC/DC1.8 26.4,34.2 25.2,33 24.8,33 | 24.8,33 24.3,33 D2.3 | R19.2 24.76,33.04 24.8,33
N$58
  Top 0.406: C11.2 53.4,20.75 U$1.33
N$60
  Top 0.305: DC/DC1.6 25.4,35.8 25.2,35.6 24.2,35.6 23.6,36.2 23.6,37 23.2,37.4 22.24,37.4 R21.2 21.56,37.44 21.2,37.8 R20.1
PE  (via drill 3 pad 6)
  Top 0.61: 79.4,3.2 arc-90 76.8,0.6 3.2,0.6 arc-90 0.6,3.2 | 79.4,3.2 79.4,46.6 arc90 76.6,49.4 | 76.6,49.4 3.2,49.4 | 3.2,49.4 arc90 0.6,46.8 0.6,3.2 | v76.8,46.8 76.8,49.2 76.6,49.4 | v76.8,3.2 79.4,3.2 | 0.6,3.2 v3.2,3.2 | v3.2,46.8 3.2,49.4
PE1
  Bottom 0.61: 0.6,3.2 arc90 3.2,0.6 76.8,0.6 arc90 79.4,3.2 | 0.6,3.2 0.6,46.6 arc-90 3.4,49.4 | 3.4,49.4 76.8,49.4 | 76.8,49.4 arc-90 79.4,46.8 79.4,3.2 | 3.2,46.8 3.2,49.2 3.4,49.4 | 3.2,3.2 0.6,3.2 | 79.4,3.2 76.8,3.2 | 76.8,46.8 76.8,49.4
RESET  (via drill 0.4 pad 1.27)
  Top 0.406: v50.8,19.2 51.36,19.76 U$1.32
  Bottom 0.406: JP2.3 49.2,17.6 v50.8,19.2
VCC  (via drill 0.4 pad 1.27)
  Top 0.305: I_IC1.P$2 15.75,28.15 | 15.75,28.15 v15.4,27.8 15.1,28.1 I_IC1.P$1 | 16.6,10.4 DRV1.24 DRV1.23 | I_IC1.P$3 16.4,28.8 15.75,28.15 | 16.6,22 16.71,21.89 DRV1.1 DRV1.2 | C6.2 8.05,18.2 v8,18.2
  Top 0.813: v5.4,8 15.4,8 16.6,9.2 16.6,10.4 | v15.4,27.8 15.4,25 16.6,23.8 16.6,22
  Bottom 0.305: v8,18.2 5.4,18.2
  Bottom 0.813: v15.4,27.8 7.4,27.8 5.4,25.8 5.4,18.2 v5.4,8
(copper drawn outside any net)
  shapes: Top area x12, Top circle x3

### Text on the board
Top: RX | TX | VCC | GND | A | B | Mazilyauskas | GND
tStop: RX | TX | VCC | GND | A | B | Mazilyauskas | GND